# Altium schematic sheet Sheet1.SchDoc
size A; SheetNumber: 1; SheetTotal: 1
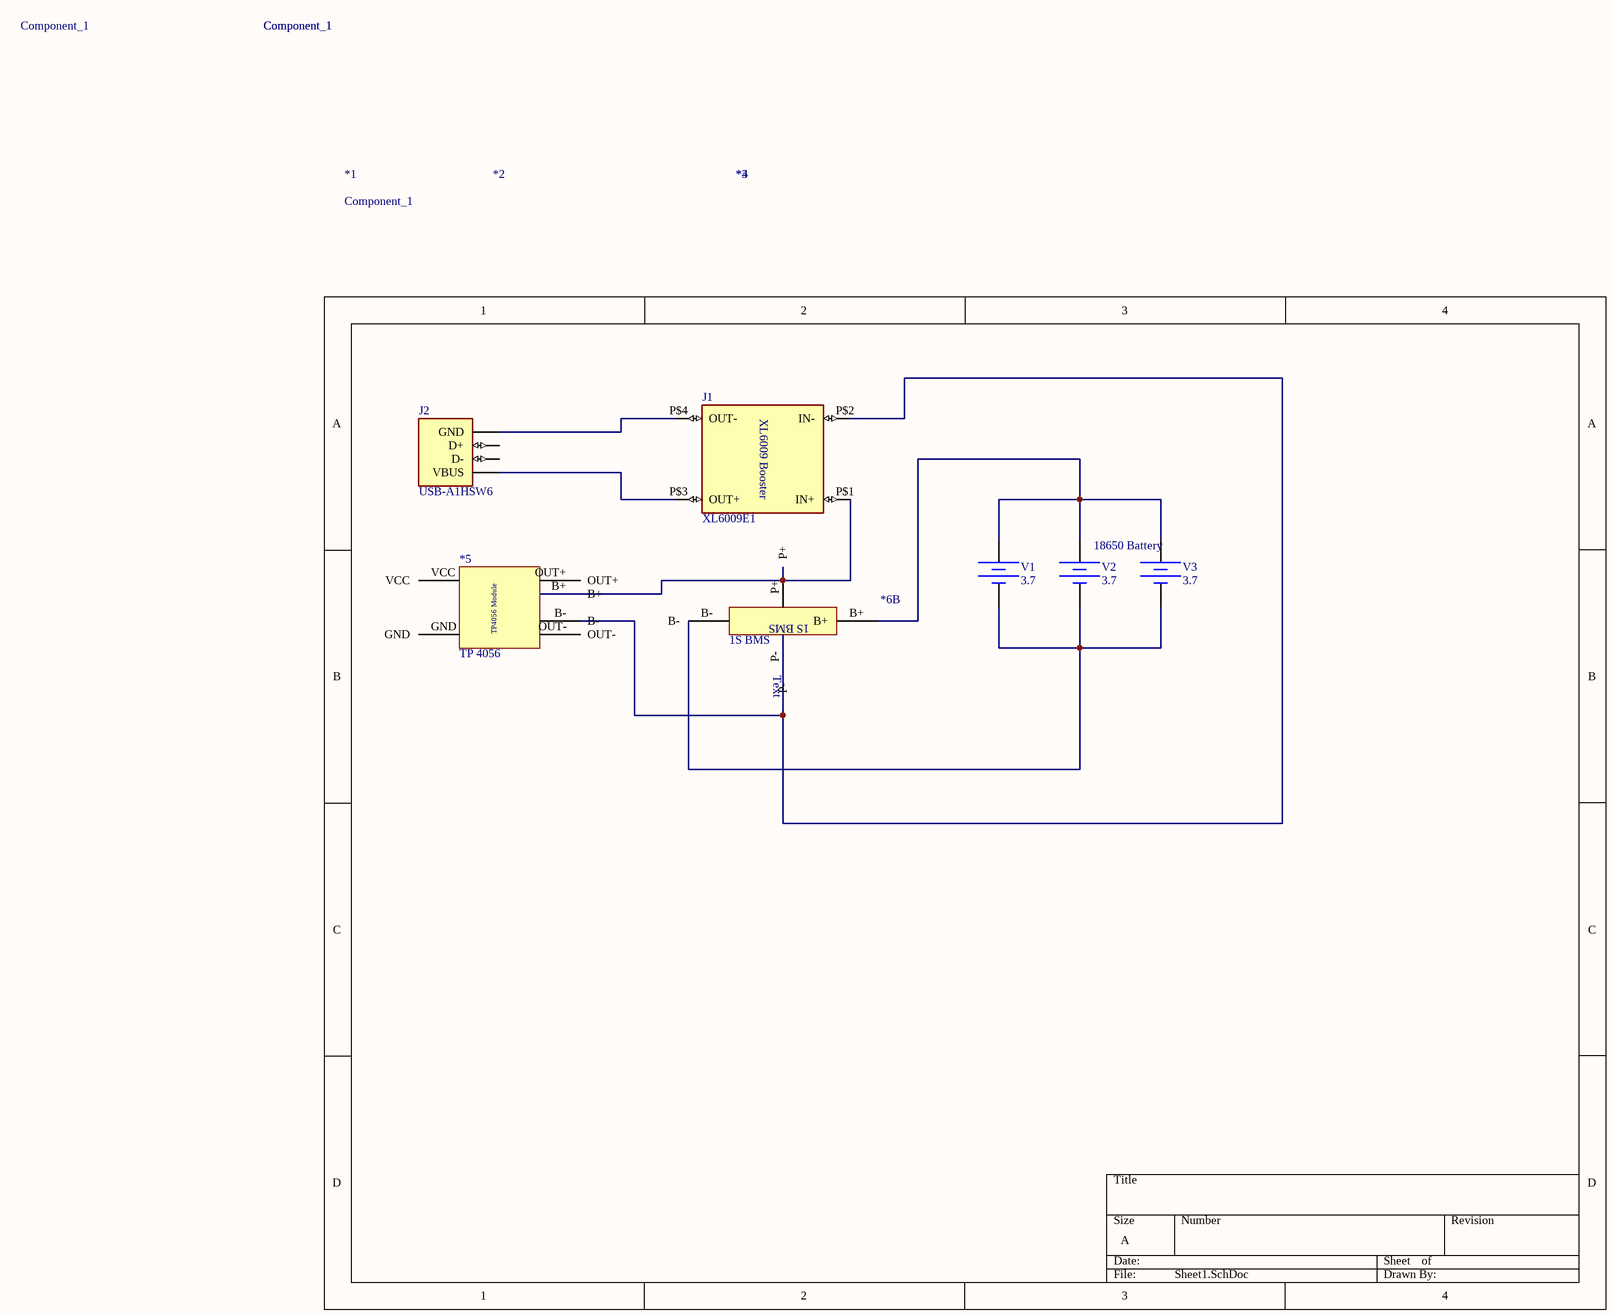
[diagram p0: Sheet1.SchDoc]

## Parts
*1  Component_1
*2  Component_1
*3  Component_1
*4  Component_1
*5  TP 4056
*6  1S BMS  (part B of 2)
J1  XL6009E1  [XL6009E1]
J2  USB-A1HSW6  [OST_USB-A1HSW6]
V1  DC Magnitude: 3.7  (hidden comment: Constant Voltage Source)
V2  DC Magnitude: 3.7  (hidden comment: Constant Voltage Source)
V3  DC Magnitude: 3.7  (hidden comment: Constant Voltage Source)

## Nets
Net*5_B+: *5.B+ J1.P$1(IN+)
Net*6_B+: *6.B+ V1.1 V2.1 V3.1
Net*6_P-: *6.P- J1.P$2(IN-)
NetJ1_P$3: J1.P$3(OUT+) J2.1(VBUS)
NetJ1_P$4: J1.P$4(OUT-) J2.4(GND)
NetV1_2: V1.2 V2.2 V3.2

Not connected (* = marked no-connect by the designer): *5 B- GND OUT+ OUT- VCC; *6 B- P+; J2 2(D-) 3(D+)

## Notes on the sheet
- 18650 Battery
- (in symbol Component_1) TP4056 Module
- (in symbol Component_1, part B) Text
- (in symbol XL6009E1) XL6009 Booster

## Library data of the parts
*5 *6 = Component_1
J1 = XL6009E1: 400KHz 60V 4A Switching Current Boost / Buck-Boost / Inverting DC/DC Converter; MF: XLSEMI; SnapEDA_Link: https://www.snapeda.com/parts/XL6009E1/XLSEMI/view-part/?ref=snap; Package: Package; Value: *; MP: XL6009E1; Check_prices: https://www.snapeda.com/parts/XL6009E1/XLSEMI/view-part/?ref=eda
J2 = USB-A1HSW6: MF: {'manufacturer': u'On Shore Technology Inc.'}; Package: None; Price: None; Value: *; MP: USB-A1HSW6; Availability: Unavailable
V1-V3 = Battery: SimulationGenericComponent: True